# EasyEDA Pro project Controller PCB.eprj

# Schematic Schematic1
Board Name: Board1; Create Date: 2024-10-02
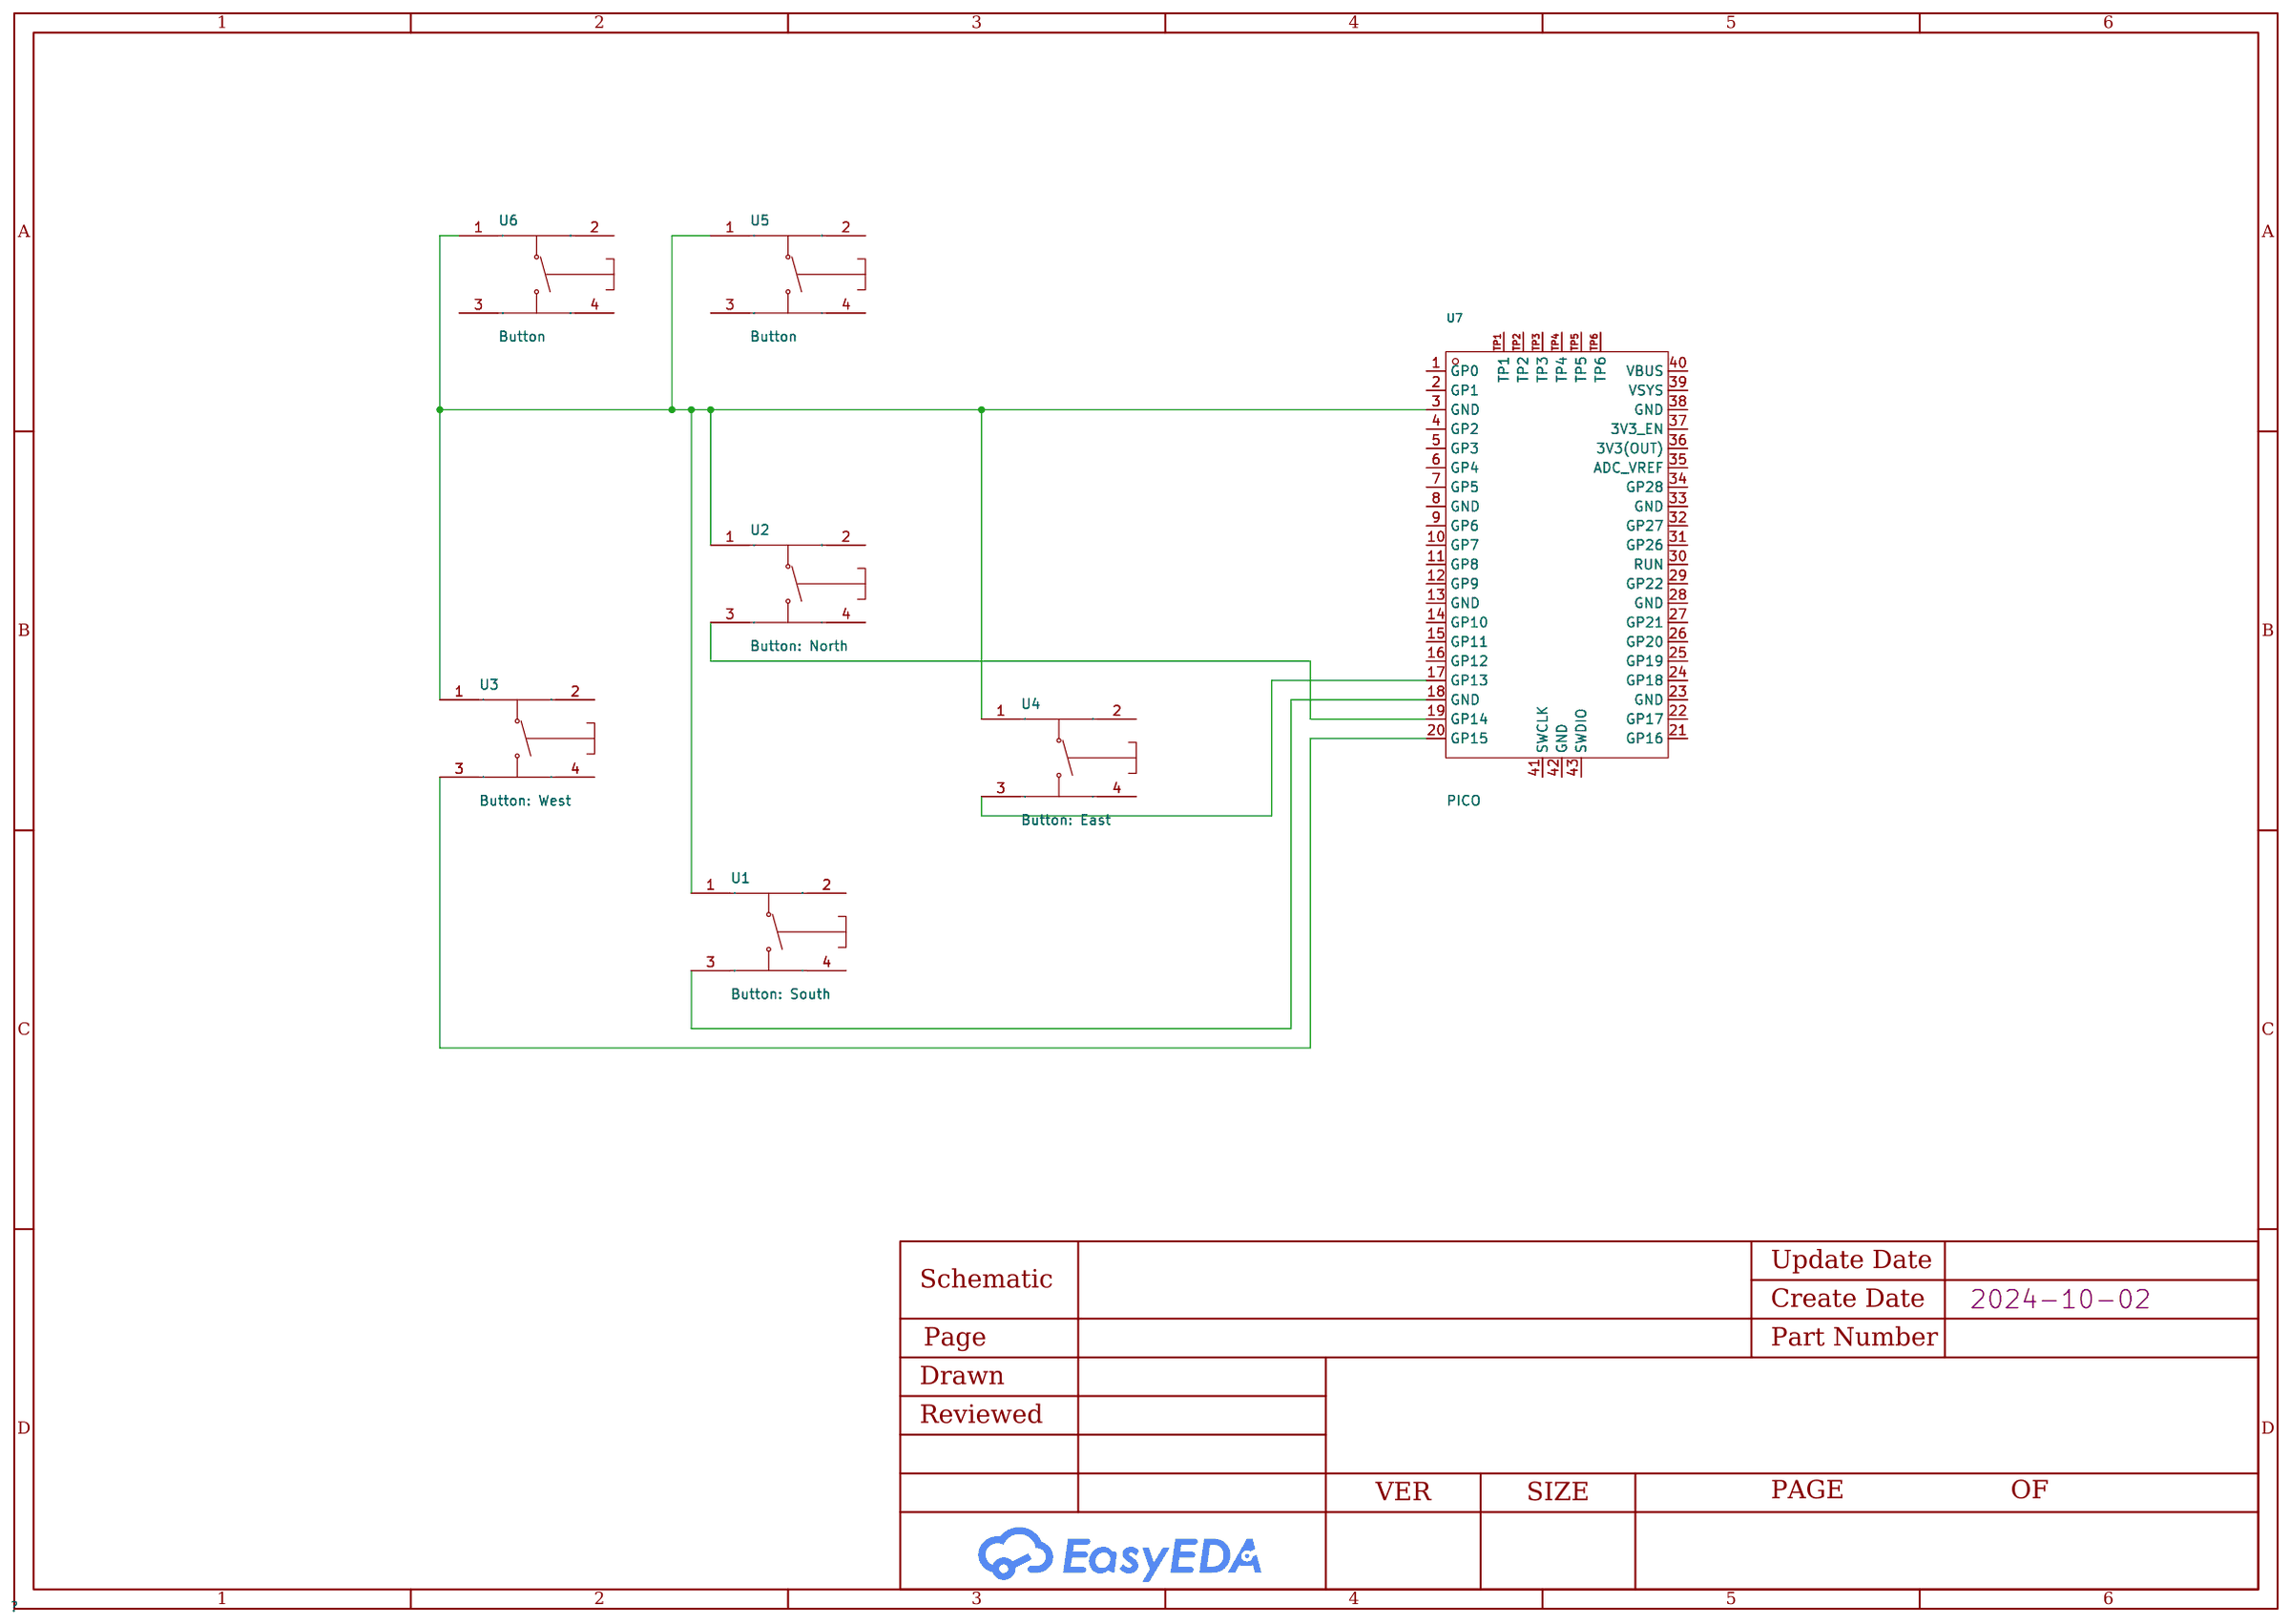
[diagram p0: schematic sheet]

## Parts
U1  Button: South  [SW-SMD_4P-L5.1-W5.1-P3.70-LS6.5-TL-2]
U2  Button: North  [SW-SMD_4P-L5.1-W5.1-P3.70-LS6.5-TL-2]
U3  Button: West  [SW-SMD_4P-L5.1-W5.1-P3.70-LS6.5-TL-2]
U4  Button: East  [SW-SMD_4P-L5.1-W5.1-P3.70-LS6.5-TL-2]
U5  Button  [SW-SMD_4P-L5.1-W5.1-P3.70-LS6.5-TL-2]
U6  Button  [SW-SMD_4P-L5.1-W5.1-P3.70-LS6.5-TL-2]
U7  PICO  [COMM-SMD_L51.0-W21.0-P2.54_SC0916]

## Library data of the parts
U1-U6 = button: Supplier Part: C9900016052; Supplier Footprint: SW-PB; Supplier: LCSC
U7 = PICO: Supplier Part: C7203002; Manufacturer: Raspberry Pi(树莓派); JLCPCB Part Class: Extended Part; Datasheet: https://atta.szlcsc.com/upload/public/pdf/source/20230906/086376002DDC9866828648BC93E51F8B.pdf; Supplier: LCSC

## Nets
Net-(U1-1): U1.1 U2.1 U3.1 U4.1 U5.1 U6.1 U7.3(GND)
Net-(U1-3): U1.3 U7.18(GND)
Net-(U2-3): U2.3 U7.19(GP14)
Net-(U3-3): U3.3 U7.20(GP15)
Net-(U4-3): U4.3 U7.17(GP13)

Not connected (* = marked no-connect by the designer): U1 2 4; U2 2 4; U3 2 4; U4 2 4; U5 2 3 4; U6 2 3 4; U7 1(GP0) 2(GP1) 4(GP2) 5(GP3) 6(GP4) 7(GP5) 8(GND) 9(GP6) 10(GP7) 11(GP8) 12(GP9) 13(GND) 14(GP10) 15(GP11) 16(GP12) 21(GP16) 22(GP17) 23(GND) 24(GP18) 25(GP19) 26(GP20) 27(GP21) 28(GND) 29(GP22) 30(RUN) 31(GP26) 32(GP27) 33(GND) 34(GP28) 35(ADC_VREF) 36(3V3(OUT)) 37(3V3_EN) 38(GND) 39(VSYS) 40(VBUS) 41(SWCLK) 42(GND) 43(SWDIO) TP1 TP2 TP3 TP4 TP5 TP6
